# EAGLE design main_board-v2.2 (EAGLE 6.4)
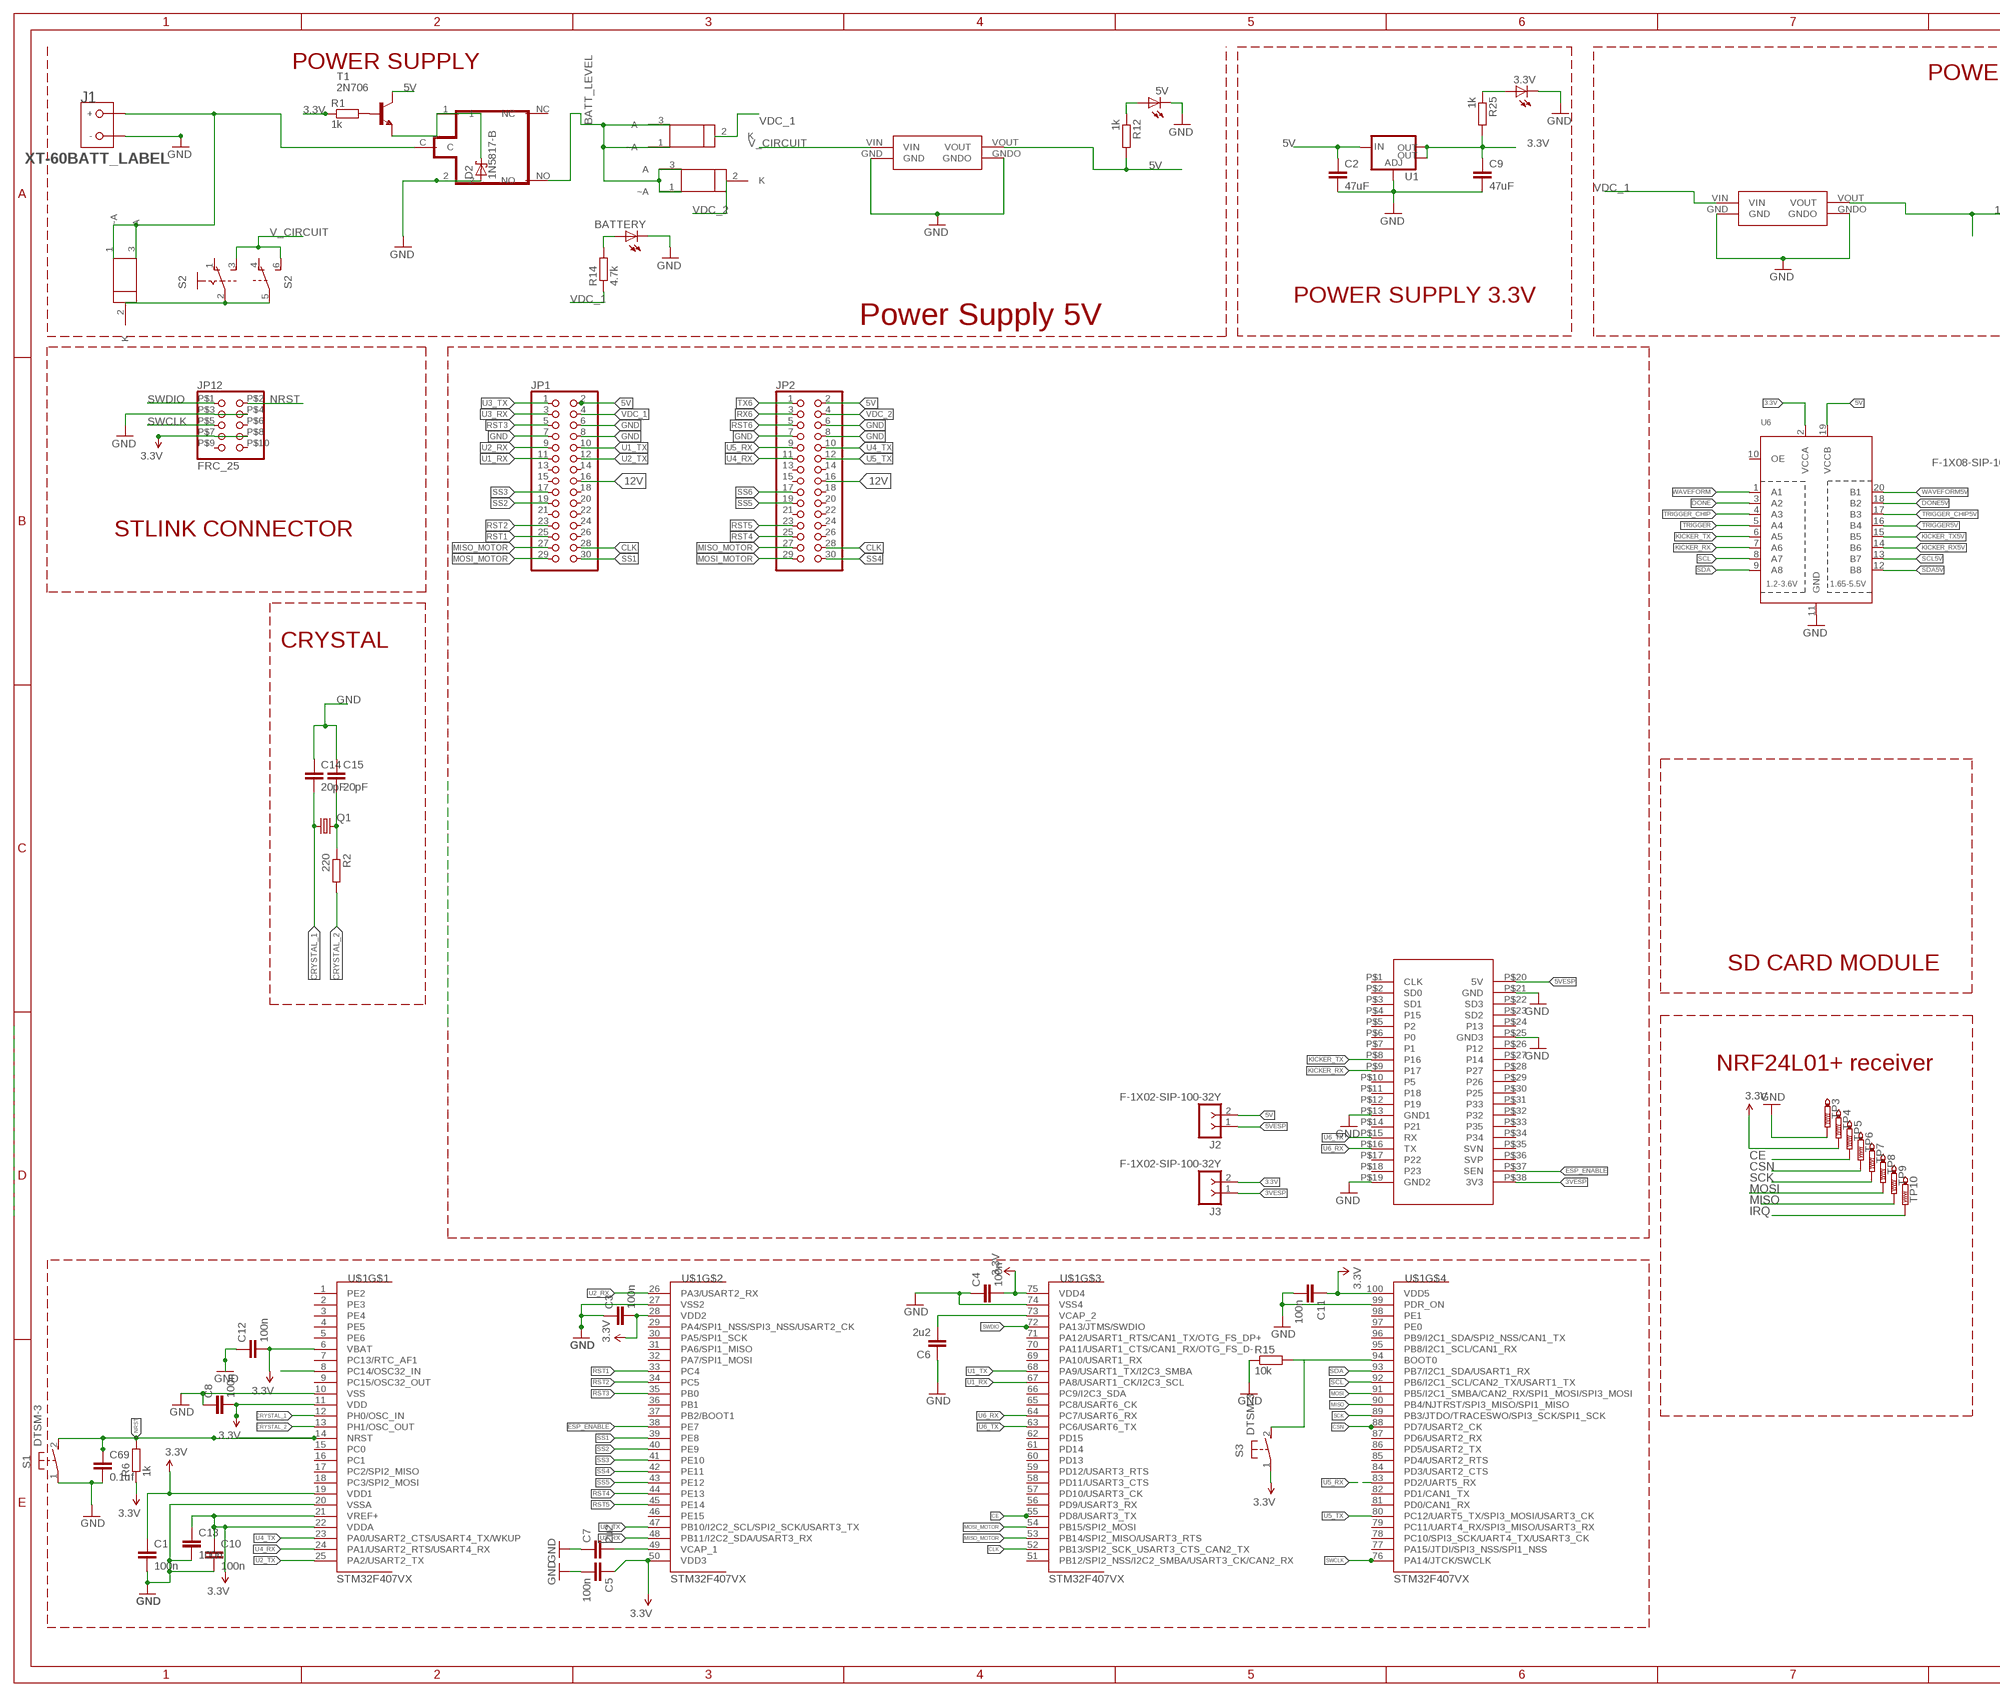
[diagram p0: schematic, sheet 1, part 1 of 2]
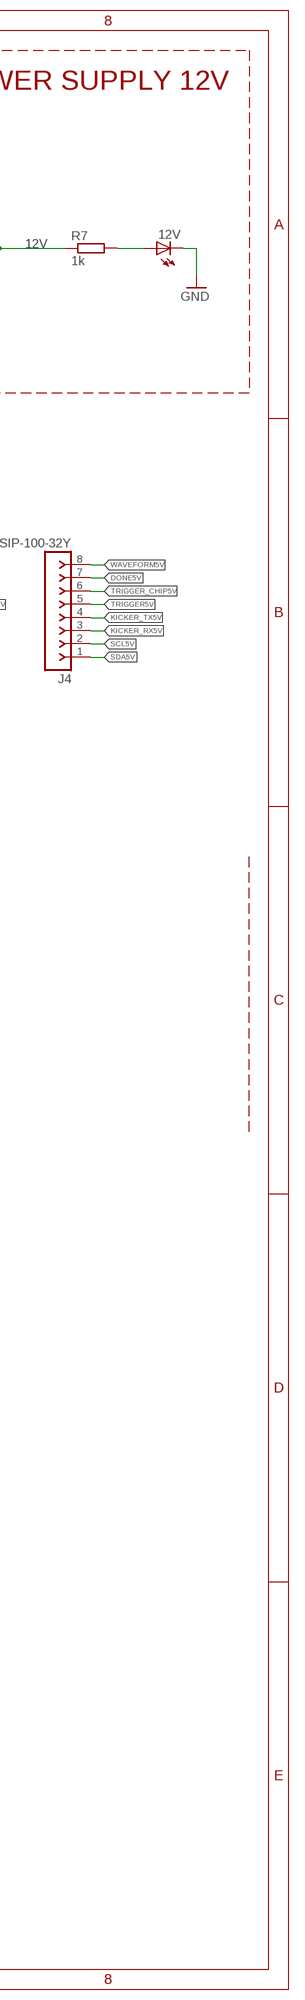
[diagram p1: schematic, sheet 1, part 2 of 2]

## Parts
3.3V  LEDCHIPLED_0805  [CHIPLED_0805]
5V  LEDCHIPLED_0805  [CHIPLED_0805]
12V  LEDCHIPLED_0805  [CHIPLED_0805]
BATTERY  LEDCHIPLED_0805  [CHIPLED_0805]
C1  100n  C-EUC1206  [C1206]
C2  47uF  C-EUC1206  [C1206]
C3  100n  C-EUC1206  [C1206]
C4  100n  C-EUC1206  [C1206]
C5  100n  C-EUC1206  [C1206]
C6  2u2  C-EUC1206  [C1206]
C7  2u2  C-EUC1206  [C1206]
C8  100n  C-EUC1206  [C1206]
C9  47uF  C-EUC1206  [C1206]
C10  100n  C-EUC1206  [C1206]
C11  100n  C-EUC1206  [C1206]
C12  100n  C-EUC1206  [C1206]
C13  100n  C-EUC1206  [C1206]
C14  20pF  C-EUC1206  [C1206]
C15  20pF  C-EUC1206  [C1206]
C69  0.1uf  C-EUC1206  [C1206]
D2  1N5817-B  [DO41-7.6]
J1  XT-60BATT_LABEL  [XT-60]
J2  F-1X02-SIP-100-32Y  [SIP-100-02-32Y]
J3  F-1X02-SIP-100-32Y  [SIP-100-02-32Y]
J4  F-1X08-SIP-100-32Y  [SIP-100-08-32Y]
JP1  PINHD-2X15_2.54  [2X15]
JP2  PINHD-2X15_2.54  [2X15]
JP12  FRC_25  [FRC2*5]
Q1  CRYSTALHC49U-V  [HC49U-V]
R1  1k  R-EU_R1206  [R1206]
R2  220  R-EU_R1206  [R1206]
R6  1k  R-EU_R1206  [R1206]
R7  1k  R-EU_R1206  [R1206]
R12  1k  R-EU_R1206  [R1206]
R14  4.7k  R-EU_R1206  [R1206]
R15  10k  R-EU_R1206  [R1206]
R25  1k  R-EU_R1206  [R1206]
S1  DTSM-3  [DTSM-3]
S2  A68-A31  [A68-A31]
S3  DTSM-3  [DTSM-3]
T1  2N706  [TO18]
TP3  PTR1PAD1-13  [P1-13]
TP4  PTR1PAD1-13  [P1-13]
TP5  PTR1PAD1-13  [P1-13]
TP6  PTR1PAD1-13  [P1-13]
TP7  PTR1PAD1-13  [P1-13]
TP8  PTR1PAD1-13  [P1-13]
TP9  PTR1PAD1-13  [P1-13]
TP10  PTR1PAD1-13  [P1-13]
U1  V_REG_LM1117SOT223  [SOT223]
U2  LP38690DT-3.3  [TO228P1042X238-3N]
U3  LP38690DT-3.3  [TO228P1042X238-3N]
U4  LP38690DT-3.3  [TO228P1042X238-3N]
U6  TXB0108PWR  [TSSOP20]
U$1  STM32F407VX  [LQFP100]
U$2  REL  [REL]
U$3  BUCK  [BUCK]
U$4  BUCK  [BUCK]
U$6  NODEMCU32S  [NODEMCU32]

## Nets
3.3V: C1.1 C3.2 C4.2 C5.1 C8.2 C9.1 C10.1 C11.1 C12.2 C13.1 J3.2 JP12.P$7 JP12.P$8 R1.1 R6.1 R25.2 S3.1 TP4.TP U1.2(OUT) U1.4(OUT) U6.2(VCCA) U$1.6(VBAT) U$1.11(VDD) U$1.19(VDD1) U$1.21(VREF+) U$1.22(VDDA) U$1.28(VDD2) U$1.50(VDD3) U$1.75(VDD4) U$1.100(VDD5)
3VESP: J3.1 U$6.P$38(3V3)
5V: C2.1 J2.2 JP1.2 JP2.2 R12.2 T1.3(C) U1.3(IN) U6.19(VCCB) U$3.VOUT
5VESP: J2.1 U$6.P$20(5V)
12V: JP1.16 JP2.16 R7.1 U$4.VOUT
BATT_LEVEL: U2.1(~A) U2.3(A) U4.1(~A) U4.3(A) U$2.NO
CE: TP5.TP U$1.55(PD8/USART3_TX)
CLK: JP1.28 JP2.28 U$1.52(PB13/SPI2_SCK_USART3_CTS_CAN2_TX)
CRYSTAL_1: C14.2 Q1.1 U$1.12(PH0/OSC_IN)
CRYSTAL_2: R2.2 U$1.13(PH1/OSC_OUT)
CSN: TP6.TP U$1.88(PD7/USART2_CK)
DONE: U6.3(A2)
DONE5V: J4.7 U6.18(B2)
ESP_ENABLE: U$1.38(PE7) U$6.P$37(SEN)
GND: 3.3V.C 5V.C 12V.C BATTERY.C C1.2 C2.2 C3.1 C4.1 C5.2 C6.1 C7.1 C8.1 C9.2 C10.2 C11.2 C12.1 C13.2 C14.1 C15.1 C69.2 D2.A J1.GND(-) JP1.6 JP1.7 JP1.8 JP2.6 JP2.7 JP2.8 JP12.P$3 JP12.P$4 R15.1 S1.1 TP3.TP U1.1(ADJ) U6.11(GND) U$1.10(VSS) U$1.20(VSSA) U$1.27(VSS2) U$1.74(VSS4) U$1.99(PDR_ON) U$2.2 U$3.GND U$3.GNDO U$4.GND U$4.GNDO U$6.P$13(GND1) U$6.P$19(GND2) U$6.P$21(GND) U$6.P$25(GND3)
INPUT: J1.BATT(+) U3.1(~A) U3.3(A) U$2.C
IRQ: TP10.TP
IRQ_SPI2: U$1.8(PC14/OSC32_IN)
KICKER_RX: U6.7(A6) U$6.P$9(P17)
KICKER_RX5V: J4.3 U6.14(B6)
KICKER_TX: U6.6(A5) U$6.P$8(P16)
KICKER_TX5V: J4.4 U6.15(B5)
MISO: TP9.TP U$1.90(PB4/NJTRST/SPI3_MISO/SPI1_MISO)
MISO_MOTOR: JP1.27 JP2.27 U$1.53(PB14/SPI2_MISO/USART3_RTS)
MOSI: TP8.TP U$1.91(PB5/I2C1_SMBA/CAN2_RX/SPI1_MOSI/SPI3_MOSI)
MOSI_MOTOR: JP1.29 JP2.29 U$1.54(PB15/SPI2_MOSI)
N$3: C7.2 U$1.49(VCAP_1)
N$4: C6.2 U$1.73(VCAP_2)
N$6: R15.2 S3.2 U$1.94(BOOT0)
N$10: C15.2 Q1.2 R2.1
N$12: 5V.A R12.1
N$14: 12V.A R7.2
N$18: BATTERY.A R14.2
N$19: 3.3V.A R25.1
N$21: R1.2 T1.2(B)
N$22: D2.C T1.1(E) U$2.1
N$25: S2.2(A:P) S2.5(B:P) U3.2(K)
NRST: C69.1 JP12.P$2 R6.2 S1.2 U$1.14(NRST)
RST1: JP1.25 U$1.33(PC4)
RST2: JP1.23 U$1.34(PC5)
RST3: JP1.5 U$1.35(PB0)
RST4: JP2.25 U$1.44(PE13)
RST5: JP2.23 U$1.45(PE14)
RST6: JP2.5
RX6: JP2.3
SCK: TP7.TP U$1.89(PB3/JTDO/TRACESWO/SPI3_SCK/SPI1_SCK)
SCL: U6.8(A7) U$1.92(PB6/I2C1_SCL/CAN2_TX/USART1_TX)
SCL5V: J4.2 U6.13(B7)
SDA: U6.9(A8) U$1.93(PB7/I2C1_SDA/USART1_RX)
SDA5V: J4.1 U6.12(B8)
SS1: JP1.30 U$1.39(PE8)
SS2: JP1.19 U$1.40(PE9)
SS3: JP1.17 U$1.41(PE10)
SS4: JP2.30 U$1.42(PE11)
SS5: JP2.19 U$1.43(PE12)
SS6: JP2.17
SWCLK: JP12.P$5 U$1.76(PA14/JTCK/SWCLK)
SWDIO: JP12.P$1 U$1.72(PA13/JTMS/SWDIO)
TRIGGER: U6.5(A4)
TRIGGER5V: J4.5 U6.16(B4)
TRIGGER_CHIP: U6.4(A3)
TRIGGER_CHIP5V: J4.6 U6.17(B3)
TX6: JP2.1
U1_RX: JP1.11 U$1.67(PA8/USART1_CK/I2C3_SCL)
U1_TX: JP1.10 U$1.68(PA9/USART1_TX/I2C3_SMBA)
U2_RX: JP1.9 U$1.26(PA3/USART2_RX)
U2_TX: JP1.12 U$1.25(PA2/USART2_TX)
U3_RX: JP1.3 U$1.48(PB11/I2C2_SDA/USART3_RX)
U3_TX: JP1.1 U$1.47(PB10/I2C2_SCL/SPI2_SCK/USART3_TX)
U4_RX: JP2.11 U$1.24(PA1/USART2_RTS/USART4_RX)
U4_TX: JP2.10 U$1.23(PA0/USART2_CTS/USART4_TX/WKUP)
U5_RX: JP2.9 U$1.83(PD2/UART5_RX)
U5_TX: JP2.12 U$1.80(PC12/UART5_TX/SPI3_MOSI/USART3_CK)
U6_RX: U$1.64(PC7/USART6_RX) U$6.P$16(TX)
U6_TX: U$1.63(PC6/USART6_TX) U$6.P$15(RX)
V_CIRCUIT: S2.3(A:S) S2.6(B:S) U$3.VIN
VDC_1: JP1.4 R14.1 U4.2(K) U$4.VIN
VDC_2: JP2.4 U2.2(K)
WAVEFORM: U6.1(A1)
WAVEFORM5V: J4.8 U6.20(B1)
Unconnected: JP1.13 JP1.14 JP1.15 JP1.18 JP1.20 JP1.21 JP1.22 JP1.24 JP1.26 JP2.13 JP2.14 JP2.15 JP2.18 JP2.20 JP2.21 JP2.22 JP2.24 JP2.26 JP12.P$6 JP12.P$9 JP12.P$10 S2.1(A:O) S2.4(B:O) U6.10(OE) U$1.1(PE2) U$1.2(PE3) U$1.3(PE4) U$1.4(PE5) U$1.5(PE6) U$1.7(PC13/RTC_AF1) U$1.9(PC15/OSC32_OUT) U$1.15(PC0) U$1.16(PC1) U$1.17(PC2/SPI2_MISO) U$1.18(PC3/SPI2_MOSI) U$1.29(PA4/SPI1_NSS/SPI3_NSS/USART2_CK) U$1.30(PA5/SPI1_SCK) U$1.31(PA6/SPI1_MISO) U$1.32(PA7/SPI1_MOSI) U$1.36(PB1) U$1.37(PB2/BOOT1) U$1.46(PE15) U$1.51(PB12/SPI2_NSS/I2C2_SMBA/USART3_CK/CAN2_RX) U$1.56(PD9/USART3_RX) U$1.57(PD10/USART3_CK) U$1.58(PD11/USART3_CTS) U$1.59(PD12/USART3_RTS) U$1.60(PD13) U$1.61(PD14) U$1.62(PD15) U$1.65(PC8/USART6_CK) U$1.66(PC9/I2C3_SDA) U$1.69(PA10/USART1_RX) U$1.70(PA11/USART1_CTS/CAN1_RX/OTG_FS_D-) U$1.71(PA12/USART1_RTS/CAN1_TX/OTG_FS_DP+) U$1.77(PA15/JTDI/SPI3_NSS/SPI1_NSS) U$1.78(PC10/SPI3_SCK/UART4_TX/USART3_CK) U$1.79(PC11/UART4_RX/SPI3_MISO/USART3_RX) U$1.81(PD0/CAN1_RX) U$1.82(PD1/CAN1_TX) U$1.84(PD3/USART2_CTS) U$1.85(PD4/USART2_RTS) U$1.86(PD5/USART2_TX) U$1.87(PD6/USART2_RX) U$1.95(PB8/I2C1_SCL/CAN1_RX) U$1.96(PB9/I2C1_SDA/SPI2_NSS/CAN1_TX) U$1.97(PE0) U$1.98(PE1) U$2.NC U$6.P$1(CLK) U$6.P$2(SD0) U$6.P$3(SD1) U$6.P$4(P15) U$6.P$5(P2) U$6.P$6(P0) U$6.P$7(P1) U$6.P$10(P5) U$6.P$11(P18) U$6.P$12(P19) U$6.P$14(P21) U$6.P$17(P22) U$6.P$18(P23) U$6.P$22(SD3) U$6.P$23(SD2) U$6.P$24(P13) U$6.P$26(P12) U$6.P$27(P14) U$6.P$28(P27) U$6.P$29(P26) U$6.P$30(P25) U$6.P$31(P33) U$6.P$32(P32) U$6.P$33(P35) U$6.P$34(P34) U$6.P$35(SVN) U$6.P$36(SVP)

## Notes on the sheet
- POWER SUPPLY
- POWER SUPPLY 12V
- POWER SUPPLY 3.3V
- Power Supply 5V
- STLINK CONNECTOR
- CRYSTAL
- SD CARD MODULE
- NRF24L01+ receiver

## Library data of the parts
3.3V 5V 12V BATTERY = led:LED: LED OSRAM: - CHIPLED LG R971, LG N971, LY N971, LG Q971, LY Q971, LO R971, LY R971 LH N974, LH R974 LS Q976, LO Q976, LY Q976 LO Q996 - Hyper CHIPLED LW Q18S LB Q993, LB Q99A, LB R99A - SideLED LS A670, LO A670, LY A670, LG A670, LP A670 LB A673, LV A673, LT A673, LW A673 LH A674 LY A675 LS A676, LA A676, LO A676, LY A676, LW A676 LS A679, LY A679, LG A679 - Hyper Micro SIDELED® LS Y876, LA Y876, LO Y876, LY Y876 LT Y87S - SmartLED LW L88C, LW L88S LB L89C, LB L89S, LG L890 LS L89K, LO L89K, LY L89K LS L896, LA L896, LO L896, LY L896 - TOPLED LS T670, LO T670, LY T670, LG T670, LP T670 LSG T670, LSP T670, LSY T670, LOP T670, LYG T670 LG T671, LOG T671, LSG T671 LB T673, LV T673, LT T673, LW T673 LH T674 LS T676, LA T676, LO T676, LY T676, LB T676, LH T676, LSB T676, LW T676 LB T67C, LV T67C, LT T67C, LS T67K, LO T67K, LY T67K, LW E67C LS E67B, LA E67B, LO E67B, LY E67B, LB E67C, LV E67C, LT E67C LW T67C LS T679, LY T679, LG T679 LS T770, LO T770, LY T770, LG T770, LP T770 LB T773, LV T773, LT T773, LW T773 LH T774 LS E675, LA E675, LY E675, LS T675 LS T776, LA T776, LO T776, LY T776, LB T776 LHGB T686 LT T68C, LB T68C - Hyper Mini TOPLED® LB M676 - Mini TOPLED Santana® LG M470 LS M47K, LO M47K, LY M47K Source: http://www.osram.convergy.de LUXEON: - LUMILED® LXK2-PW12-R00, LXK2-PW12-S00, LXK2-PW14-U00, LXK2-PW14-V00 LXK2-PM12-R00, LXK2-PM12-S00, LXK2-PM14-U00 LXK2-PE12-Q00, LXK2-PE12-R00, LXK2-PE12-S00, LXK2-PE14-T00, LXK2-PE14-U00 LXK2-PB12-K00, LXK2-PB12-L00, LXK2-PB12-M00, LXK2-PB14-N00, LXK2-PB14-P00, LXK2-PB14-Q00 LXK2-PR12-L00, LXK2-PR12-M00, LXK2-PR14-Q00, LXK2-PR14-R00 LXK2-PD12-Q00, LXK2-PD12-R00, LXK2-PD12-S00 LXK2-PH12-R00, LXK2-PH12-S00 LXK2-PL12-P00, LXK2-PL12-Q00, LXK2-PL12-R00 Source: www.luxeon.com KINGBRIGHT: KA-3528ASYC Source: www.kingbright.com
C1-C15 C69 = rcl:C-EU: CAPACITOR, European symbol
D2 = diode:1N581*: 1.0A SCHOTTKY BARRIER RECTIFIER Source: http://www.diodes.com/datasheets/ds23001.pdf
J1 = RoboJackets-Connectors:XT-60: XT-60 Power Connector Distributor: HobbyKing <http://www.hobbyking.com/hobbyking/store/RC_PRODUCT_SEARCH.asp?strSearch=xt-60>
J2 J3 = con-headers-jp:F-1X02-: FEMALE HEADER
J4 = con-headers-jp:F-1X08-: FEMALE HEADER
JP1 JP2 = pinhead-1:PINHD-2X15: PIN HEADER
JP12 = mohit:FRC_2*5
Q1 = crystal:CRYSTAL: CRYSTAL; OC_FARNELL: 1666969; OC_NEWARK: unknown
R1 R2 R6 R7 R12 R14 R15 R25 = resistor:R-EU_: RESISTOR, European symbol
S1 S3 = switch-tact:DTSM-3
S2 = switch:A68-A31: SLIDING SWITCH Siemens, distributor Buerklin, 11G766
T1 = transistor:2N706: NPN TRANSISTOR
TP3-TP10 = testpad:PTR1: TEST PIN
U1 = SparkFun-PowerIC:V_REG_LM1117: Voltage Regulator LM1117 Standard adjustable voltage regulator but in SMD form. Spark Fun Electronics SKU : COM-00595; PROD_ID: VREG-08170
U2-U4 = LP38690DT-3.3:LP38690DT-3.3; MPN: LP38690DT-3.3; OC_FARNELL: 1008048; OC_NEWARK: 41K7439; PACKAGE: TO-252; SUPPLIER: National Semiconductor
U6 = adafruit:TXB0108PWR: 8-Bit Bi-Directional Level Shifter 1.2V-3.6V (VCCA) to 1.65V-5.5V (VCCB) bi-directional level shifter with auto direction sensing. Max data rate - VCCA 1.8V: 20Mbps (50ns), VCCA 3.3V: 100Mbps (10ns) Digikey: 296-21527-1-ND
U$1 = STM32F407Vx_LQFP100:STM32F407VX: STmicroelectronics Cortex M4 Series Typ: STM32F407Vx LQFP100 Copyright 2012 by Ersan Günes, Quantitec, info@quantitec.de
U$2 = rel:REL
U$3 U$4 = BUCK:BUCK
U$6 = nodeMCU:NODEMCU32S

## Board
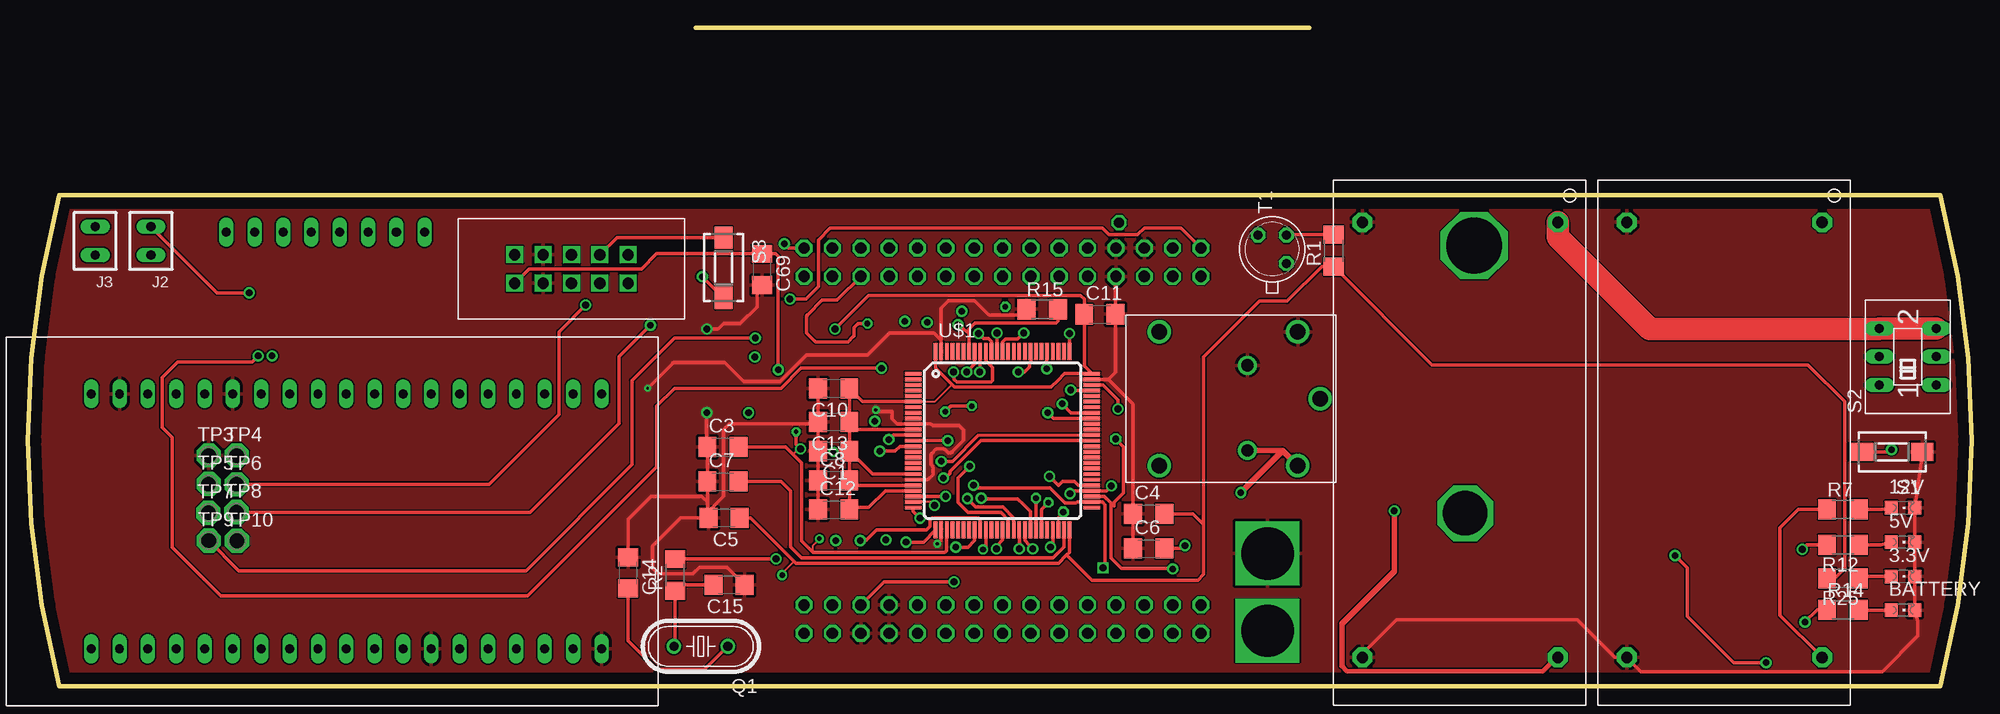
[diagram p2: board, top side]
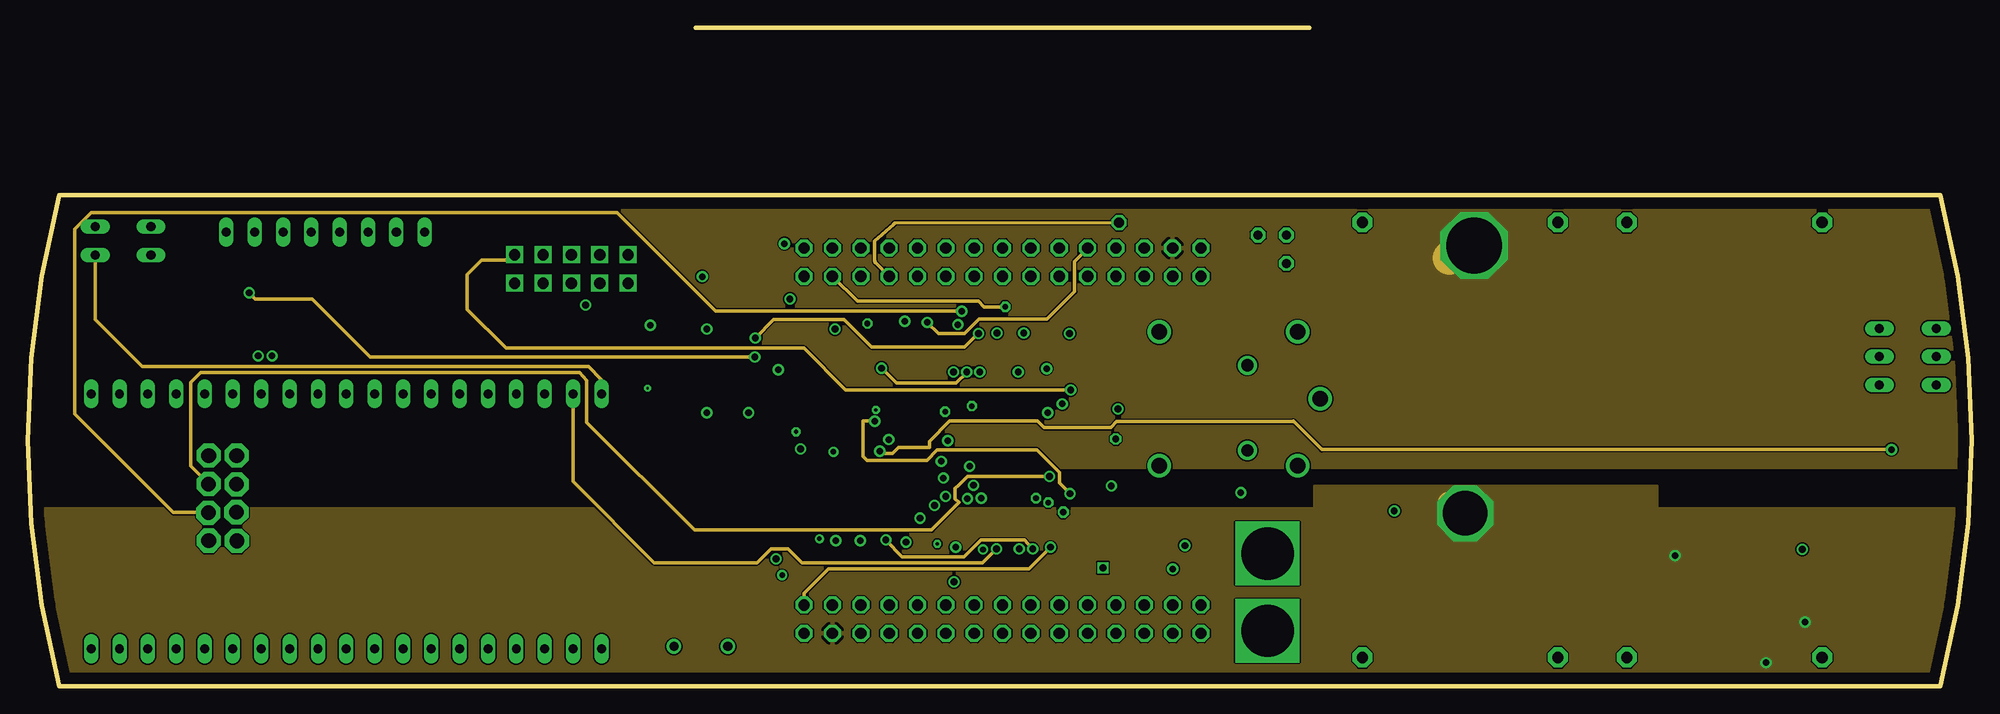
[diagram p3: board, inner layer Route2]
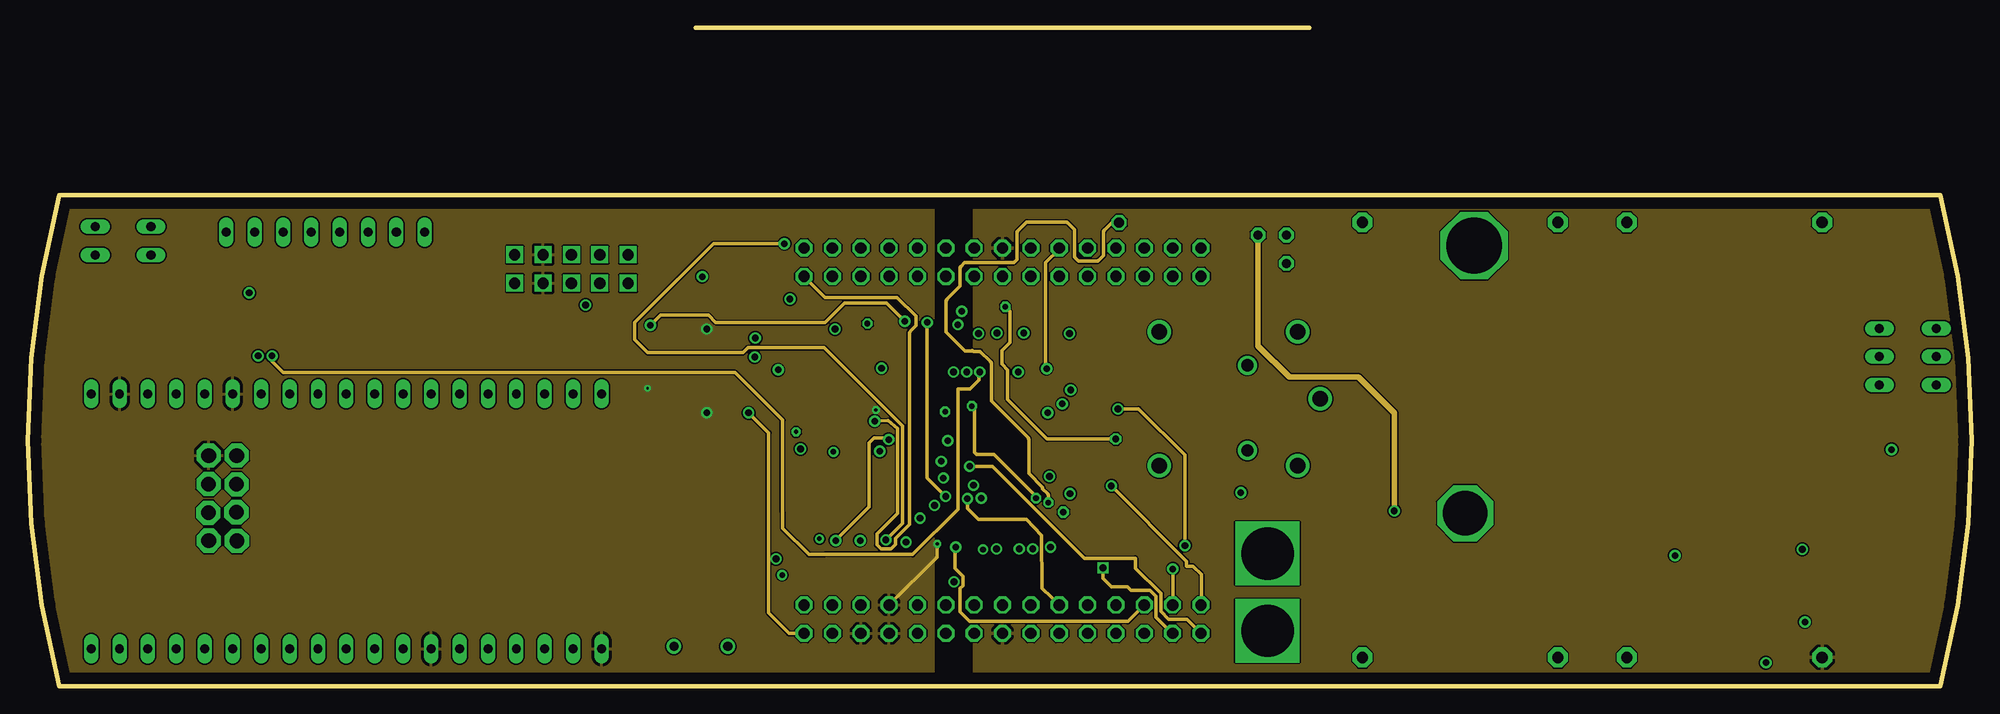
[diagram p4: board, inner layer Route15]
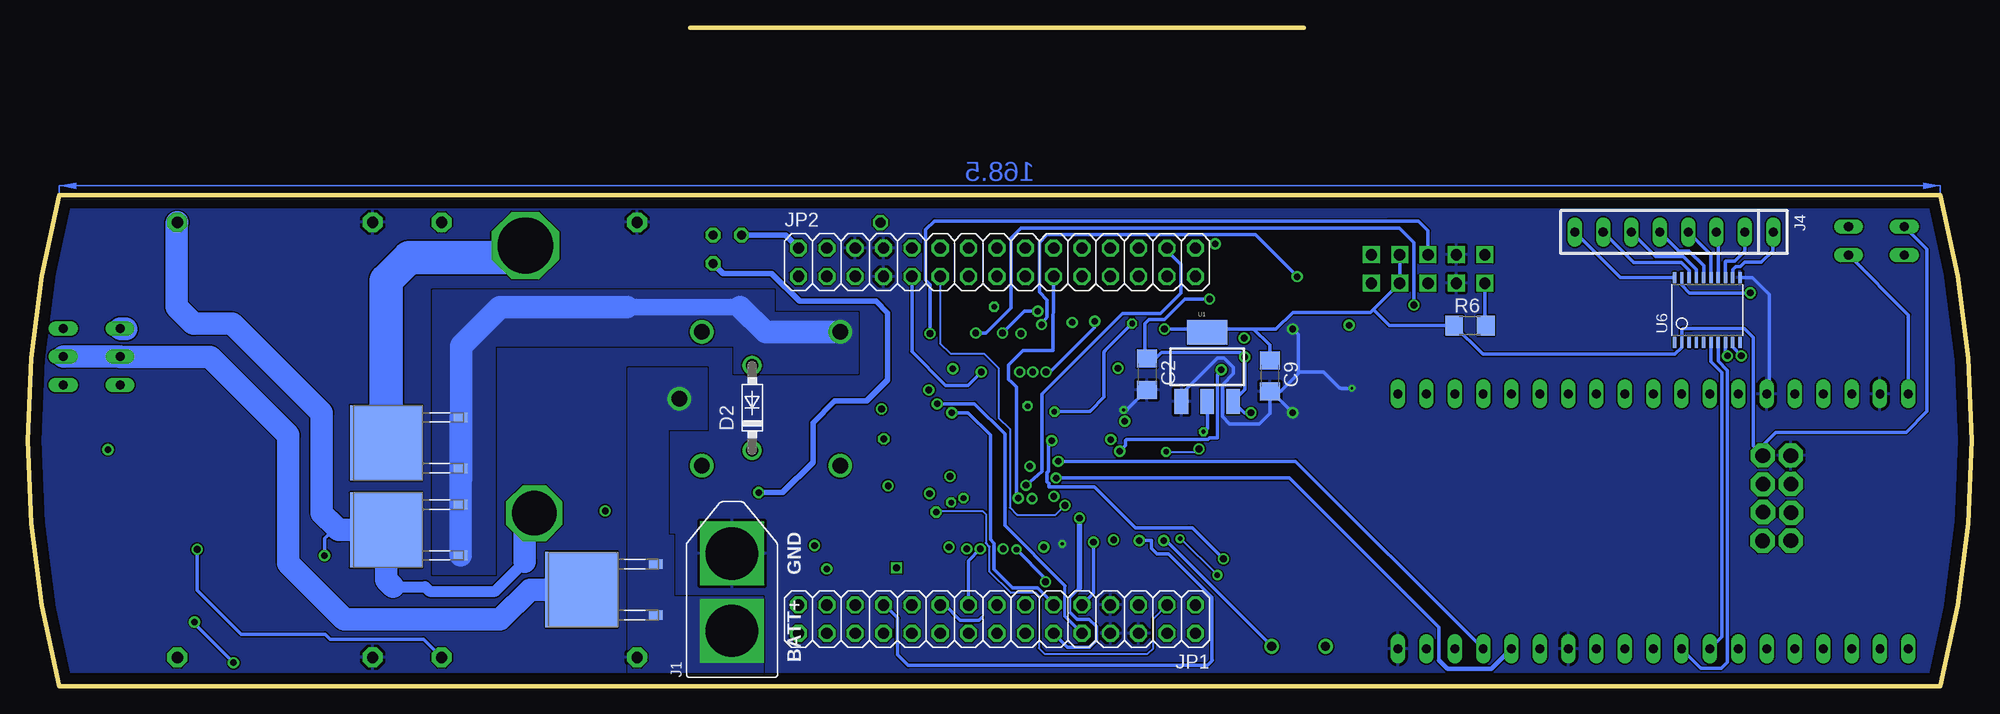
[diagram p5: board, bottom side, seen from below]

Size 174.15 x 59 mm. Coordinates in mm from the lower left corner, seen from the top.
Outline: 114.83,59 59.83,59
Outline: 2.83,44 171.33,44 arc-29 171.33,0 2.83,0 arc-29 2.83,44
Copper layers (1*2*15*16): Top 0.035mm / dielectric 0.8mm / Route2 0.05mm / dielectric 0.63mm / Route15 0.05mm / dielectric 0.8mm / Bottom 0.035mm
Design rules "default *": minimum track width 10mil, minimum drill 24mil, track to track 0.125mm, track to pad 0.125mm, pad to pad 0.125mm, via to via 0.125mm, smd to smd 0.125mm, copper to edge 40mil, drill to drill 8mil, minimum pad ring 10mil, minimum via ring 8mil, stop-mask expansion 4mil, vias tented up to drill 0mil, thermal gap 10mil

### Footprints (pad centres in the part's own frame; a part is rotated, then mirrored left to right if it is on the bottom)
CHIPLED_0805 = smd 1.2 x 1.2: A 0,-1.05; C 0,1.05
C1206 = smd 1.6 x 1.8: 1 -1.4,0; 2 1.4,0
DO41-7.6 = drill 1.1 pad 1.7: A 3.81,0; C -3.81,0
XT-60 = drill 4.7 square: BATT 0,4.154; GND 0,11.092
SIP-100-02-32Y = drill 0.813 long: 1 -1.27,0; 2 1.27,0
SIP-100-08-32Y = drill 0.813 long: 1 -8.89,0; 2 -6.35,0; 3 -3.81,0; 4 -1.27,0; 5 1.27,0; 6 3.81,0; 7 6.35,0; 8 8.89,0
2X15 = drill 1.016 octagon: 1 -17.78,-1.27; 2 -17.78,1.27; 3 -15.24,-1.27; 4 -15.24,1.27; 5 -12.7,-1.27; 6 -12.7,1.27; 7 -10.16,-1.27; 8 -10.16,1.27; 9 -7.62,-1.27; 10 -7.62,1.27; 11 -5.08,-1.27; 12 -5.08,1.27; 13 -2.54,-1.27; 14 -2.54,1.27; 15 0,-1.27; 16 0,1.27; 17 2.54,-1.27; 18 2.54,1.27; 19 5.08,-1.27; 20 5.08,1.27; 21 7.62,-1.27; 22 7.62,1.27; 23 10.16,-1.27; 24 10.16,1.27; 25 12.7,-1.27; 26 12.7,1.27; 27 15.24,-1.27; 28 15.24,1.27; 29 17.78,-1.27; 30 17.78,1.27
FRC2*5 = drill 1.016 square: P$1 -5.08,1.27; P$2 -5.08,-1.27; P$3 -2.54,1.27; P$4 -2.54,-1.27; P$5 0,1.27; P$6 0,-1.27; P$7 2.54,1.27; P$8 2.54,-1.27; P$9 5.08,1.27; P$10 5.08,-1.27
HC49U-V = drill 0.813: 1 -2.413,0; 2 2.413,0
R1206 = smd 1.6 x 1.803: 1 -1.422,0; 2 1.422,0
DTSM-3 = smd 2 x 1.6: 1 -2.7,0; 2 2.7,0
A68-A31 = drill 0.813 long: 1 -2.54,-2.54; 2 0,-2.54; 3 2.54,-2.54; 4 -2.54,2.54; 5 0,2.54; 6 2.54,2.54
TO18 = drill 0.813 octagon: 1 -1.27,-1.27; 2 1.27,-1.27; 3 1.27,1.27
P1-13 = drill 1.321 pad 2.159 octagon: TP 0,0
SOT223 = smd 1.219 x 2.235: 1 -2.311,-3.099; 2 0,-3.099; 3 2.311,-3.099 | smd 3.6 x 2.2: 4 0,3.099
TO228P1042X238-3N = smd 0.889 x 1.219: 1 -2.286,-6.502; 3 2.286,-6.502 | smd 6.731 x 6.502: 2 0,0.152
TSSOP20 = smd 0.305 x 0.991: 1 -2.925,-2.918; 2 -2.275,-2.918; 3 -1.625,-2.918; 4 -0.975,-2.918; 5 -0.325,-2.918; 6 0.325,-2.918; 7 0.975,-2.918; 8 1.625,-2.918; 9 2.275,-2.918; 10 2.925,-2.918; 11 2.925,2.918; 12 2.275,2.918; 13 1.625,2.918; 14 0.975,2.918; 15 0.325,2.918; 16 -0.325,2.918; 17 -0.975,2.918; 18 -1.625,2.918; 19 -2.275,2.918; 20 -2.925,2.918
LQFP100 = smd 1.5 x 0.35: 1 -8,6; 2 -8,5.5; 3 -8,5; 4 -8,4.5; 5 -8,4; 6 -8,3.5; 7 -8,3; 8 -8,2.5; 9 -8,2; 10 -8,1.5; 11 -8,1; 12 -8,0.5; 13 -8,0; 14 -8,-0.5; 15 -8,-1; 16 -8,-1.5; 17 -8,-2; 18 -8,-2.5; 19 -8,-3; 20 -8,-3.5; 21 -8,-4; 22 -8,-4.5; 23 -8,-5; 24 -8,-5.5; 25 -8,-6; 51 8,-6; 52 8,-5.5; 53 8,-5; 54 8,-4.5; 55 8,-4; 56 8,-3.5; 57 8,-3; 58 8,-2.5; 59 8,-2; 60 8,-1.5; 61 8,-1; 62 8,-0.5; 63 8,0; 64 8,0.5; 65 8,1; 66 8,1.5; 67 8,2; 68 8,2.5; 69 8,3; 70 8,3.5; 71 8,4; 72 8,4.5; 73 8,5; 74 8,5.5; 75 8,6 | smd 0.35 x 1.5: 26 -6,-8; 27 -5.5,-8; 28 -5,-8; 29 -4.5,-8; 30 -4,-8; 31 -3.5,-8; 32 -3,-8; 33 -2.5,-8; 34 -2,-8; 35 -1.5,-8; 36 -1,-8; 37 -0.5,-8; 38 0,-8; 39 0.5,-8; 40 1,-8; 41 1.5,-8; 42 2,-8; 43 2.5,-8; 44 3,-8; 45 3.5,-8; 46 4,-8; 47 4.5,-8; 48 5,-8; 49 5.5,-8; 50 6,-8; 76 6,8; 77 5.5,8; 78 5,8; 79 4.5,8; 80 4,8; 81 3.5,8; 82 3,8; 83 2.5,8; 84 2,8; 85 1.5,8; 86 1,8; 87 0.5,8; 88 0,8; 89 -0.5,8; 90 -1,8; 91 -1.5,8; 92 -2,8; 93 -2.5,8; 94 -3,8; 95 -3.5,8; 96 -4,8; 97 -4.5,8; 98 -5,8; 99 -5.5,8; 100 -6,8
REL = drill 1.4: 1 6.2,-6.4; 2 6.2,5.6; C 8.2,-0.4; NC -6.2,-6.4; NO -6.2,5.6
BUCK = drill 1.016 pad 1.778 octagon: GND 0,0; GNDO 39,0; VIN 0,17.5; VOUT 39,17.5
NODEMCU32 = drill 0.8 long: P$1 0,0; P$2 0,-2.54; P$3 0,-5.08; P$4 0,-7.62; P$5 0,-10.16; P$6 0,-12.7; P$7 0,-15.24; P$8 0,-17.78; P$9 0,-20.32; P$10 0,-22.86; P$11 0,-25.4; P$12 0,-27.94; P$13 0,-30.48; P$14 0,-33.02; P$15 0,-35.56; P$16 0,-38.1; P$17 0,-40.64; P$18 0,-43.18; P$19 0,-45.72; P$20 22.86,0; P$21 22.86,-2.54; P$22 22.86,-5.08; P$23 22.86,-7.62; P$24 22.86,-10.16; P$25 22.86,-12.7; P$26 22.86,-15.24; P$27 22.86,-17.78; P$28 22.86,-20.32; P$29 22.86,-22.86; P$30 22.86,-25.4; P$31 22.86,-27.94; P$32 22.86,-30.48; P$33 22.86,-33.02; P$34 22.86,-35.56; P$35 22.86,-38.1; P$36 22.86,-40.64; P$37 22.86,-43.18; P$38 22.86,-45.72

### Placement (x,y rotation side)
3.3V  168.01,9.83 270 top
5V  168.01,12.9 270 top
12V  168.01,15.98 270 top
BATTERY  168.01,6.81 270 top
C1  72.2,21.06 180 top
C2  73.89,27.95 270 bottom
C3  62.28,21.44 0 top
C4  100.43,15.44 0 top
C5  62.38,15.06 180 top
C6  100.43,12.33 0 top
C7  62.28,18.33 0 top
C8  72.2,18.44 0 top
C9  62.89,27.8 270 bottom
C10  72.2,26.67 180 top
C11  96.05,33.33 0 top
C12  72.2,15.83 0 top
C13  72.2,23.67 180 top
C14  53.77,10.15 270 top
C15  62.83,9.06 180 top
C69  65.77,37.35 270 top
D2  109.27,24.94 90 bottom
J1  111.07,0.8 0 bottom
J2  11.03,39.9 90 top
J3  6.03,39.9 90 top
J4  26.67,40.7 180 bottom
JP1  87.33,6 180 bottom
JP2  87.33,38 0 bottom
JP12  48.7,37.39 0 top
Q1  60.3,3.56 180 top
R1  117,39.04 90 top
R2  58,9.96 90 top
R6  44.95,32.33 0 bottom
R7  162.63,15.83 0 top
R12  162.63,12.67 180 top
R14  162.63,6.83 0 top
R15  90.89,33.78 0 top
R25  162.63,9.67 180 top
S1  167.03,21 180 top
S2  168.44,29.53 90 top
S3  62.33,37.5 270 top
T1  111.5,39.16 90 top
TP3  16.2,20.66 0 top
TP4  18.72,20.66 0 top
TP5  16.19,18.11 0 top
TP6  18.7,18.09 0 top
TP7  16.17,15.54 0 top
TP8  18.69,15.59 0 top
TP9  16.21,13.04 0 top
TP10  18.73,13.01 0 top
U1  68.49,28.62 0 bottom
U2  141.89,21.81 90 bottom
U3  124.39,8.65 90 bottom
U4  141.89,13.99 90 bottom
U6  23.69,33.71 0 bottom
U$1  87.33,22 0 top
U$2  107.58,26.15 0 top
U$3  119.58,41.57 270 top
U$4  143.27,41.57 270 top
U$6  5.67,3.34 90 top

### Tracks (layer width: path | path; a pad name or v marks a point on that pad's centre or on a via)
3.3V  (via drill 0.4, 0.5, 0.6)
  Top 0.2: C1.1 72.34,21.06 v72.18,21 | v69.23,21.25 69.03,21.25 68.55,20.77 | 70.33,12 70.33,12.6 v70.93,13.2 | v67.58,9.95 67.58,10.1 68.65,11.18 | U$1.6 81.28,25.5 82.8,27.02
  Top 0.3: C13.1 C10.1 74.77,25.5 U$1.6 | C13.1 C1.1 | C8.2 C1.1 | C8.2 C12.2 73.77,16 75.33,16 76.83,17.5 U$1.22 | U$1.21 74.04,18 C8.2 | U$1.19 75.66,19 C1.1 | U$1.11 74.27,23 C13.1 | C3.2 67.89,21.44 68.55,20.77 69.33,20 69.33,13 70.33,12 82.07,12 arc90 82.33,12.25 U$1.28 | C5.1 64.77,15.06 68.65,11.18 68.83,11 92.33,11 93.08,11.75 | 93.08,11.75 93.33,12 U$1.50 | 81.33,28.5 U$1.100 | C4.2 104.39,15.44 105.33,14.5 | 105.33,14.5 105.33,10 104.83,9.5 95.33,9.5 93.08,11.75 | v72.33,32 75.33,35 94.33,35 94.65,34.68 C11.1 94.65,28.68 U$1.75 92.88,28 92.28,27.4 | 105.33,14.5 105.33,29.5 110.33,34.5 112.83,34.5 115.94,37.62 R1.1 125.81,28.8 159.48,28.8 162.78,25.5 162.78,10.55 161.9,9.67 R25.2 | S3.1 52.78,40.2 JP12.P$7 | v68.83,22.8 68.83,21.65 v69.23,21.25
  Top 0.305: 81.33,28.5 82.8,27.02 83.03,26.8 91.68,26.8 92.28,27.4
  Bottom 0.2: v72.18,21 69.48,21 v69.23,21.25 | v70.93,13.2 70.83,13.2 v67.58,9.95
  Bottom 0.3: v72.33,32 68.77,32 U1.4 68.2,32 64.33,32 | C9.1 62.89,30.56 64.33,32 | 64.33,32 62.33,32 60.83,33.5 53.86,33.5 53.59,33.77 | 53.59,33.77 JP12.P$8 JP12.P$7 | R6.1 52.16,32.33 53.59,33.77 | U1.2 68.49,23.09 v68.83,22.8 | 25.96,31.16 25.96,31.96 25.88,32.05 25.08,32.05
  Bottom 0.305: 25.08,32.05 20.38,32.05 19.58,31.25 19.58,21.52 TP4.TP 18.72,21.56 17.53,22.75 5.88,22.75 4.03,24.6 4.03,39.17 J3.2 | 25.96,31.16 U6.2 25.96,30.37 26.58,29.75 43.79,29.75 R6.1
3VESP
  Route2 0.305: J3.1 6.03,32.85 10.23,28.65 50.23,28.65 51.38,27.5 U$6.P$38
5V  (via drill 0.6)
  Top 0.3: R12.2 159.4,12.67 v158.98,12.25
  Top 0.305: v19.83,35.25 16.95,35.25 J2.2 | JP2.2 103.33,41.05 100.03,41.05 99.43,40.45 96.88,40.45 96.28,41.05 71.88,41.05 70.83,40 70.83,35.8 69.73,34.7 v68.28,34.7
  Top 0.406: 117.73,1.8 118.18,1.35 135.73,1.35 136.95,2.57 U$3.VOUT
  Top 0.5: v122.43,15.7 122.43,10.3 117.73,5.6 117.73,1.8
  Route2 0.305: v65.13,29.5 30.68,29.5 25.48,34.7 20.38,34.7 v19.83,35.25
  Route15 0.305: v64.58,24.5 66.38,22.7 66.38,6.55 68.2,4.73 JP1.2
  Route15 0.5: T1.3 110.23,30.5 113.03,27.7 119.23,27.7 122.43,24.5 v122.43,15.7
  Bottom 0.3: 73.74,29.5 C2.1 | v158.98,12.25 158.98,8.6 155.03,4.65 147.53,4.65 147.08,4.2 138.71,4.2 U$3.VOUT
  Bottom 0.305: U6.19 25.96,35.94 25.28,35.25 v19.83,35.25 | v64.58,24.5 65.15,24.5 U1.3 65.13,26.57 v65.13,29.5 65.53,29.9 72.58,29.9 73.13,29.35 C2.1 74.08,29.54 74.08,32.5 73.73,32.85 72.33,32.85 70.48,34.7 v68.28,34.7
  Bottom 0.5: T1.3 106.27,40.43 JP2.2
5VESP
  Bottom 0.305: U$6.P$20 5.67,33.27 J2.1
12V
  Top 0.3: R7.1 158.61,15.83 156.98,14.2 156.98,6.36 U$4.VOUT
  pour Route15: 86.33,5.3 86.33,0.75 161.98,0.75 161.98,5.3
  pour Route15: 86.33,34.05 86.33,43.15 161.98,43.15 161.98,33 157.83,33 157.83,4.8 153.78,4.8 153.68,34.05
  pour Route15 (rank 6): 85.33,47.1 84.73,47.1 84.73,-8.1 174.33,-8.1 174.33,51.7 85.33,51.7
BATT_LEVEL
  Bottom 1.5: 110.33,34 120.48,34
  Bottom 2: U4.1 U4.3 U2.1 | U2.1 135.38,18.5 135.33,18.56 135.33,30.5 131.83,34 120.48,34 | U2.1 U2.3 | U$2.NO 108.08,31.75 110.33,34
  pour Bottom (no thermals): 99.83,33.5 99.83,28 110.83,28 110.83,30.5 132.33,30.5 132.33,10 137.83,10 137.83,35.5 107.33,35.5 107.33,33.5
CE  (via drill 0.6)
  Top 0.3: U$1.55 94.13,18 93.78,18.35 92.68,18.35 92.33,18
  Top 0.305: 92.33,18 v91.53,18.8
  Route2 0.3: 83.43,18.05 83.08,17.7 83.08,16.8 83.43,16.45
  Route2 0.305: v91.53,18.8 84.18,18.8 83.43,18.05 | 83.43,16.45 80.98,14 59.73,14 50.08,23.65 50.08,27.4 49.43,28.1 15.48,28.1 14.58,27.2 14.58,19.72 TP5.TP
CLK  (via drill 0.6)
  Top 0.3: U$1.52 94.03,16.5 93.93,16.4 92.93,16.4 91.58,17.75 84.98,17.75 v84.73,18 | 96.53,16.25 96.53,10.8 v96.33,10.6
  Top 0.305: U$1.52 96.28,16.5 96.53,16.25
  Route15 0.3: v96.33,10.6 96.33,9.65 97.08,8.9 98.53,8.9 98.83,8.6
  Route15 0.305: JP1.28 102.5,4.73 101.08,6.15 101.08,8.05 100.53,8.6 98.83,8.6
  Bottom 0.3: JP2.28 72.09,39.06 70.83,37.8 70.83,35.25 72.68,33.4 76.08,33.4 83.28,26.2 83.28,19.25 v84.73,18
CRYSTAL_1  (via drill 0.6)
  Top 0.3: C14.2 53.77,4.06 56.33,1.5 60.65,1.5 Q1.1 | U$1.12 77.58,22.5 v77.13,22.1
  Route15 0.3: 75.83,22.25 77.03,22.25 v77.13,22.1
  Route15 0.305: 75.83,22.25 75.38,21.8 75.38,16.05 v72.38,13.05
  Bottom 0.305: v72.38,13.05 72.2,13.05 Q1.1
CRYSTAL_2  (via drill 0.6)
  Top 0.305: U$1.13 v82.43,22 | v67.03,11.4 58.01,11.4 R2.2
  Bottom 0.3: 70.13,14.2 69.83,14.2 v67.03,11.4 | 82.68,17.85 82.68,18.15 82.83,18.3 82.83,19.15 82.73,19.25
  Bottom 0.305: v82.43,22 82.73,21.7 82.73,19.25 | 82.68,17.85 78.58,17.85 74.93,14.2 70.13,14.2
CSN  (via drill 0.6)
  Top 0.305: TP6.TP 41.32,18.09 47.58,24.35 47.58,31.75 v49.98,34.15 | U$1.88 87.33,30.85 87.58,31.1 88.68,31.1 v89.23,31.65
  Bottom 0.305: v49.98,34.15 49.98,39.75 51.28,41.05 85.18,41.05 86.08,40.15 86.08,33.9 88.33,31.65 v89.23,31.65
DONE5V
  Bottom 0.3: U6.18 25.31,37.23 26.03,37.95 30.27,37.95 J4.7
ESP_ENABLE  (via drill 0.6)
  Top 0.305: U$1.38 87.33,13.1 86.83,12.55 v86.78,12.3
  Route2 0.305: v86.78,12.3 85.53,11.05 69.38,11.05 68.13,12.3 66.58,12.3 65.33,11.05 56.13,11.05 48.85,18.33 U$6.P$37
GND  (via drill 0.2, 0.3, 0.6)
  Top 0.3: C10.2 C13.2 | C13.2 C1.2 C8.1 C12.1 | 60.88,16.5 C7.1 C3.1 60.83,21.49 v60.83,24.5 | 60.88,16.5 60.88,15.16 C5.2 60.98,15.65 62.33,17 62.33,23 62.83,23.5 70.63,23.5 C13.2 | 96.83,27.5 99.03,25.3 C4.1 C6.1 | 96.83,27.5 U$1.74 | 96.83,27.5 97.45,28.12 C11.2 97.45,36.69 JP2.7 | C14.1 53.77,14.94 55.83,17 60.38,17 60.88,16.5 | v60.83,32 61.83,32 62.33,32.5 63.83,32.5 65.33,34 65.33,35.51 C69.2 | U$3.GNDO 119.41,2.4 119.08,2.4 122.63,5.95 138.83,5.95 142.21,2.57 U$4.GNDO 144.54,1.3 166.13,1.3 169.33,4.51 169.33,5.85 BATTERY.C 3.3V.C 5V.C 12V.C 169.76,20.97 S1.1 | U$1.27 81.83,13.21 arc-45 81.75,13.03 v81.48,12.75 | U$1.20 80.52,18.5 arc45 80.7,18.57 81.08,18.95 81.08,19.59 arc45 81,19.77 80.93,19.85 80.93,20.7 arc-45 81,20.87 81.38,21.25 82.02,21.25 arc-45 82.2,21.18 82.48,20.9 82.62,20.9 arc45 82.8,20.97 83.83,22 83.83,22.95 83.43,23.35 81.18,23.35 arc-45 81,23.42 80.93,23.5 U$1.10 77.88,23.5 77.43,23.95 77.43,24.6 76.23,24.6 arc-45 76.05,24.67 v75.98,24.75 | R15.1 89.01,33.32 arc-45 88.83,33.25 86.13,33.25 84.9,34.48 arc45 84.72,34.55 82.48,34.55 81.9,33.97 arc45 81.83,33.8 U$1.99 81.83,30.89 arc45 81.75,31.07 81.18,31.65 77.28,31.65 arc45 77.1,31.58 75.23,29.7 69.88,29.7 arc45 69.7,29.63 67.38,27.3 64.23,27.3 arc-45 64.05,27.37 62.43,29 57.93,29 arc45 57.75,28.93 v55.53,26.7
  Top 0.305: C15.1 62.64,10.65 60.18,10.65 59.58,10.05 56.48,10.05 55.98,10.55 55.98,12.55 58.49,15.06 C5.2
  Route15 0.3: v81.48,12.75 81.48,11.69 arc-45 81.4,11.51 JP1.7
  Bottom 0.3: C9.2 62.89,24.44 63.83,23.5 | U1.1 | C9.2 62.73,26.4 v60.83,24.5 | C9.2 61.93,26.4 60.33,28 60.33,28.15 | 60.33,28.15 60.33,31.5 v60.83,32 | U6.11 19.65,36.63 18.13,35.1 18.13,26.44 U$6.P$25 | v75.98,24.75 75.79,24.75 arc-45 75.61,24.82 C2.2 | v55.53,26.7 56.52,26.7 arc45 56.7,26.77 58.08,28.15 60.33,28.15
  Bottom 0.305: U1.1 70.8,26.18 67.58,29.4 66.98,29.4 66.13,28.55 66.13,28 67.13,27 67.13,24.15 66.48,23.5 63.83,23.5
  pour Bottom (rank 6): -7.17,49 -8.67,49 -8.67,-19.5 181.33,-19.5 181.33,52 -7.17,52
  pour Top (rank 6): -15.17,53.5 -15.17,-26.5 194.83,-26.5 194.83,52.5 -13.17,52.5 -13.17,54 -15.17,54
  pour Route15 (rank 6): -6.92,65.65 81.13,65.65 81.13,-12.95 -6.92,-12.95
INPUT
  pour Bottom (no thermals): 113.33,28.5 113.33,23 116.83,23 116.83,13.5 116.33,13.5 116.33,8 108.33,8 108.33,-1 120.33,-1 120.33,28.5
KICKER_RX
  Bottom 0.305: U$6.P$9 24.25,1.6 22.43,1.6 21.88,2.15 21.88,28.3 22.71,29.13 U6.7 22.73,30.78
KICKER_RX5V
  Bottom 0.3: U6.14 22.71,40.55 J4.3
KICKER_TX
  Bottom 0.305: U$6.P$8 22.38,4.41 22.38,28.1 23.36,29.09 U6.6
KICKER_TX5V
  Bottom 0.3: U6.15 23.36,38.66 J4.4
MISO  (via drill 0.6)
  Top 0.305: U$1.90 86.33,30.9 86.08,31.15 85.63,31.15 v85.18,31.6 | v65.18,31.2 57.93,31.2 54.13,27.4 54.13,19.85 44.63,10.35 18.9,10.35 TP9.TP
  Route2 0.305: v65.18,31.2 66.83,32.85 73.13,32.85 75.58,30.4 83.93,30.4 85.13,31.6 v85.18,31.6
MISO_MOTOR  (via drill 0.5, 0.6)
  Top 0.3: U$1.53 96.48,17 97.33,16.15 97.33,16.45 98.18,17.3 98.18,21.45 v97.48,22.15
  Top 0.305: U$1.53 96.43,17 97.03,16.4 97.03,11.5 97.98,10.55 102.53,10.55 v102.58,10.5
  Route2 0.3: v87.58,34 85.68,34 85.18,34.5 74.32,34.5 JP2.27
  Route15 0.3: v97.48,22.15 91.33,22.15 87.78,25.7 87.78,28.35 87.28,28.85 87.28,30.1 87.98,30.8 87.98,33.6 v87.58,34
  Route15 0.305: v102.58,10.5 JP1.27
MOSI  (via drill 0.6)
  Top 0.305: TP8.TP 45.02,15.59 52.98,23.55 52.98,29.55 v55.78,32.35 | v82.93,28.15 82.98,27.5 83.23,27.25 86.28,27.25 86.43,27.4 86.43,28.55 85.83,29.15 U$1.91
  Route15 0.305: v55.78,32.35 56.68,33.25 60.98,33.25 61.63,32.6 71.43,32.6 73.18,34.35 76.93,34.35 v78.58,32.7
  Bottom 0.305: v78.58,32.7 78.58,32.15 82.53,28.2 82.93,28.2 v82.93,28.15
MOSI_MOTOR  (via drill 0.6)
  Top 0.3: U$1.54 96.63,17.5 v97.08,17.95
  Top 0.305: U$1.54 93.78,17.5 93.53,17.25 v93.38,17.25
  Route2 0.305: v93.38,17.25 92.43,18.2 92.43,19.15 90.43,21.15 81.48,21.15 80.58,20.25 75.18,20.25 74.83,20.6 74.83,23.75 v75.88,23.75
  Route15 0.3: 103.83,10.75 103.83,11.2 v97.08,17.95 | 77.73,13.25 78.98,14.5 78.98,31.7 79.18,31.9
  Route15 0.305: JP1.29 105.13,7.29 105.13,10 104.38,10.75 103.83,10.75 | v75.88,23.75 77.08,23.8 77.93,23.1 77.93,15.5 76.08,13.65 76.08,12.65 76.43,12.3 77.33,12.3 77.73,12.7 77.73,13.25 | 79.18,31.9 79.58,32.3 79.58,33.15 77.88,34.85 71.43,34.85 JP2.29
N$3
  Top 0.3: C7.2 67.5,18.33 68.33,17.5 68.33,12.5 69.33,11.5 91.83,11.5 92.83,12.5 U$1.49
N$4  (via drill 0.6)
  Top 0.305: U$1.73 96.33,27 97.68,25.65 v97.68,24.85 | v103.68,12.6 103.41,12.33 C6.2
  Route15 0.305: v97.68,24.85 99.53,24.85 103.68,20.7 v103.68,12.6
N$6  (via drill 0.6)
  Top 0.3: R15.2 92.31,32.73 92.13,32.55 84.88,32.55 84.33,32 84.33,31.6 | 84.33,30.75 U$1.94
  Top 0.305: S3.2 v60.43,36.7 | v83.33,32.4 84.33,31.6 84.33,30.75
  Bottom 0.305: v60.43,36.7 64.18,40.45 82.83,40.45 83.53,39.75 83.53,35.3 82.83,34.6 82.83,33.1 v83.33,32.4
N$10
  Top 0.3: C15.2 58.52,9.06 R2.1 58,3.67 Q1.2
N$12
  Top 0.3: R12.1 166.03,12.67 5V.A
N$14
  Top 0.3: R7.2 166.11,15.83 12V.A
N$18
  Top 0.3: BATTERY.A 164.07,6.81 R14.2
N$19
  Top 0.3: 3.3V.A 164.21,9.83 R25.1
N$21
  Top 0.3: R1.2 112.8,40.46 T1.2
N$22  (via drill 0.6)
  Top 0.5: D2.C 112.4,21.13 | 112.4,21.13 U$2.1 | 112.4,21.13 112.4,21.07 v108.68,17.35
  Bottom 0.5: v108.68,17.35 106.53,17.35 103.83,20.05 103.83,23.6 101.88,25.55 99.03,25.55 97.13,27.45 97.13,33.45 98.18,34.5 105.03,34.5 107.53,37 111.88,37 T1.1
N$25
  Bottom 2: U3.2 129.18,8.65 131.83,6 145.83,6 150.83,11 150.83,22.5 157.83,29.5 165.87,29.5 S2.5 S2.2
NRST  (via drill 0.6)
  Top 0.3: S1.2 166.78,21 v166.98,21.2 | v67.23,28.35 67.23,38.3 67.33,38.4 | U$1.14 78.13,21.5 77.7,21.07 76.35,21.07 v76.33,21.05
  Top 0.305: 67.33,38.4 66.98,38.75 C69.1 56.33,38.75 54.98,37.4 44.9,37.4 JP12.P$2
  Route2 0.3: v166.98,21.2 115.93,21.2 113.38,23.75 113.33,23.7 97.53,23.7 97.03,23.2 91.03,23.2 90.48,23.75 82.58,23.75 80.78,21.95 80.78,21.4 78.03,21.4 77.48,20.85 76.53,20.85 v76.33,21.05
  Bottom 0.3: JP12.P$2 43.62,32.42 R6.2 | v76.33,21.05 75.83,21.55 75.83,22 75.73,22.1 68.43,22.1 68.28,22.25 67.58,22.25
  Bottom 0.305: 67.58,22.25 67.58,27.95 67.33,28.2 v67.23,28.35
RST1  (via drill 0.6)
  Top 0.305: U$1.33 84.83,13.05 84.23,12.45 v83.13,12.45
  Route15 0.3: 83.08,10.55 83.08,12.4 v83.13,12.45 | 84.58,5.8 84.38,5.8 83.53,6.65 83.53,8.75 83.78,9
  Route15 0.305: JP1.25 98.56,5.8 84.58,5.8 | 83.78,9 83.78,9.85 83.08,10.55
RST2  (via drill 0.6)
  Top 0.305: U$1.34 85.33,14.95 85.18,15.1 81.03,15.1 80.83,14.9 80.83,14.3 80.53,14 76.03,14 75.08,13.05 v74.58,13.05
  Bottom 0.3: 68.08,7.65 68.08,7.95 71.98,11.85 72.98,11.85 73.48,12.35 73.48,13.05
  Bottom 0.305: v74.58,13.05 73.48,13.05 | 68.08,7.65 68.08,2.35 68.03,2.3 68.48,1.85 95.28,1.85 96.23,2.8 96.23,6.1 97.4,7.27 JP1.23
RST3  (via drill 0.5, 0.6)
  Top 0.3: U$1.35 85.83,12.45 v85.58,12.25 | v82.98,9.35 76.71,9.35 JP1.5
  Bottom 0.305: v85.58,12.25 82.98,9.6 v82.98,9.35
RST4  (via drill 0.5)
  Top 0.3: U$1.44 v90.33,16.85 | v84.58,25.1 82.78,25.1 arc45 82.6,25.03 v82.18,24.6 | v75.23,32.5 74.48,32.5 arc45 74.3,32.43 74.03,32.15 74.03,31.51 arc-45 73.95,31.33 73.48,30.85 70.68,30.85 arc-45 70.5,30.92 69.78,31.65 69.78,33.09 arc-45 69.85,33.27 71.18,34.6 72.39,34.6 arc45 72.57,34.67 JP2.25
  Route15 0.3: v90.33,16.85 90.33,16.89 arc45 90.25,17.07 86.58,20.75 85.13,20.75 arc-45 84.95,20.82 84.83,20.95 84.83,24.75 arc45 84.75,24.92 v84.58,25.1
  Bottom 0.3: v82.18,24.6 79.13,24.6 arc-45 78.95,24.67 77.73,25.9 77.73,29.89 arc45 77.65,30.07 v75.23,32.5
RST5  (via drill 0.5, 0.9)
  Top 0.3: U$1.45 90.83,15.75 arc-45 90.9,15.92 v91.43,16.45
  Route2 0.3: v97.78,41.55 77.68,41.5 arc45 77.55,41.38 75.88,39.9 75.88,38.12 arc45 75.95,37.95 JP2.23
  Route15 0.3: 96.45,40.87 arc45 96.38,40.7 96.38,38.6 95.95,38.17 arc-45 95.77,38.1 94.13,38.1 93.85,38.38 arc-45 93.78,38.55 93.78,40.9 93.15,41.53 arc45 92.97,41.6 89.48,41.6 88.7,40.82 arc45 88.63,40.64 88.63,38.25 88.4,38.02 arc-45 88.22,37.95 83.93,37.95 83.6,37.62 arc45 83.53,37.45 83.53,35.85 82.35,34.67 arc45 82.28,34.49 82.28,31.75 83.98,30.05 84.58,30.05 84.6,30.07 arc45 84.78,30 85.33,30 86.25,29.07 arc-45 86.33,28.89 86.33,25.55 89.6,22.27 arc-45 89.68,22.09 89.68,19.05 90.85,17.87 arc-45 90.93,17.7 91.35,17.27 arc-45 91.43,17.09 v91.43,16.45
  Route15 0.305: 96.45,40.87 97.13,41.55 v97.78,41.55
SCK  (via drill 0.6)
  Top 0.305: U$1.89 v86.83,31.65
  Route2 0.305: v83.68,33.6 61.63,33.6 52.78,42.45 5.68,42.45 4.18,40.95 4.18,24.4 13.03,15.55 TP7.TP
  Bottom 0.305: v83.68,33.6 84.88,33.6 v86.83,31.65
SCL  (via drill 0.6)
  Top 0.305: U$1.92 85.33,28.25 v85.28,28.15
  Route15 0.3: 67.63,15.55 67.63,14.15 69.98,11.8 71.38,11.8
  Route15 0.305: 71.38,11.8 79.28,11.8 83.33,15.85 83.33,26.65 84.43,26.65 85.23,27.45 v85.28,28.15 | 67.63,15.55 67.63,23.85 63.38,28.1 22.88,28.1 21.88,29.1 v21.88,29.6
  Bottom 0.305: U6.8 22.08,30.78 22.08,29.8 v21.88,29.6
SCL5V
  Bottom 0.3: J4.2 20.33,39 21.23,38.1 22.03,38.1 22.06,38.06 U6.13
SDA  (via drill 0.6)
  Top 0.305: U$1.93 84.83,28.85 v84.13,28.15 | v76.48,28.5 69.28,28.5 67.48,26.7 57.93,26.7 56.33,25.1 56.33,19.65 44.78,8.1 17.28,8.1 12.93,12.45 12.93,22.3 12.03,23.2 12.03,27.65 13.43,29.05 20.08,29.05 v20.63,29.6
  Route2 0.305: v84.13,28.15 84.13,28.1 83.18,27.15 77.83,27.15 v76.48,28.5
  Bottom 0.305: v20.63,29.6 21.41,30.38 U6.9
SDA5V
  Bottom 0.3: J4.1 17.83,40.65 17.83,39 18.83,38 20.33,38 20.73,37.6 21.13,37.6 21.41,37.31 U6.12
SS1  (via drill 0.6)
  Top 0.305: U$1.39 87.83,14.9 87.18,15.55 84.23,15.55 83.33,16.45 83.33,18.65 v84.38,19.7
  Route15 0.3: 99.23,11.45 99.23,10.55 101.53,8.3 101.53,6.7 102.18,6
  Route15 0.305: v84.38,19.7 86.43,19.7 94.68,11.45 99.23,11.45 | 102.18,6 103.84,6 JP1.30
SS2  (via drill 0.6)
  Top 0.305: U$1.40 88.33,15.1 87.38,16.05 84.93,16.05 v84.18,16.8
  Route15 0.305: v84.18,16.8 84.18,15.95 85.18,14.95 89.48,14.95 90.83,13.5 90.88,8.75 JP1.19
  Bottom 0.3: JP1.19 92,7.27 90.63,5.9 88.93,5.9 88.68,6.15
SS3  (via drill 0.6)
  Top 0.3: v88.83,12.3 U$1.41
  Bottom 0.3: JP1.17 89.87,11.21 v88.83,12.3
SS4  (via drill 0.6)
  Top 0.305: JP2.30 68.16,39.27 v67.78,39.65 | v90.03,12.3 89.33,13.05 U$1.42
  Route2 0.305: v76.88,13.1 76.88,13.05 78.33,11.6 83.88,11.6 85.38,13.1 89.28,13.1 v90.03,12.3
  Route15 0.305: v76.88,13.1 78.38,14.6 78.38,23.3 71.33,30.35 64.53,30.35 64.08,29.9 55.53,29.9 54.38,31.05 54.38,32.6 61.43,39.65 v67.78,39.65
SS5  (via drill 0.6)
  Top 0.3: 89.23,16.25 89.83,15.65 U$1.43 | 88.68,16.8 85.48,16.8 v85.43,16.85
  Top 0.305: 89.23,16.25 88.68,16.8
  Bottom 0.3: JP2.19 82.3,30.08 | 85.58,26.8 85.58,18.45 | 86.03,29.05 86.28,28.8 86.28,27.5 86.03,27.25
  Bottom 0.305: 82.3,30.08 85,30.08 86.03,29.05 | 86.03,27.25 85.58,26.8 | 85.58,18.45 85.58,17.05 v85.43,16.85
SWCLK  (via drill 0.6)
  Top 0.3: U$1.76 v93.33,31.6
  Bottom 0.3: v93.33,31.6 93.33,36 93.73,36.4 93.73,40.9 92.93,41.7 52.28,41.7 51.74,41.7
  Bottom 0.305: JP12.P$5 48.7,40.82 49.58,41.7 52.28,41.7
SWDIO  (via drill 0.6)
  Top 0.3: U$1.72 93.48,26.5 v93.43,26.55
  Route2 0.3: v93.43,26.55 73.28,26.55 69.53,30.3 42.83,30.3 39.38,33.75 39.38,36.9 40.68,38.2 43.16,38.2 JP12.P$1
TRIGGER5V
  Bottom 0.3: U6.16 24.01,37.69 25.33,39 26.24,39 J4.5
TRIGGER_CHIP5V
  Bottom 0.3: U6.17 24.66,37.34 25.83,38.5 28.28,38.5 J4.6
U1_RX  (via drill 0.6)
  Top 0.3: U$1.67 91.88,24 v91.38,24.5
  Bottom 0.3: v91.38,24.5 89.93,24.5 87.93,22.5 87.93,13.15 87.58,12.8 87.58,12.6
  Bottom 0.305: JP1.11 82.25,7.37 83.68,8.8 85.93,8.8 87.58,10.45 87.58,12.6
U1_TX  (via drill 0.6)
  Top 0.3: U$1.68 93.48,24.5 v92.68,25.3
  Bottom 0.25: 81.23,6.25 81.23,9
  Bottom 0.3: v92.68,25.3 89.33,25.3 86.63,22.6 86.63,14.4 81.4,9.18 | 81.08,6.1 JP1.10
  Bottom 0.305: 81.08,6.1 81.23,6.25 | 81.23,9 81.4,9.18
U2_RX  (via drill 0.6)
  Top 0.305: U$1.26 80.23,12.9 v78.68,12.9
  Bottom 0.3: v78.68,12.9 78.68,8.3 JP1.9
U2_TX  (via drill 0.6)
  Top 0.3: 79.33,15.85 79.33,15.65 v79.93,15.05
  Top 0.305: U$1.25 79.33,15.85
  Bottom 0.2: 80.73,6.55 80.73,8
  Bottom 0.3: 80.13,6 80.18,6 80.73,6.55 | 80.73,8 79.93,8.8
  Bottom 0.305: 80.13,6 79.08,6 78.43,5.35 78.43,4.1 79.03,3.5 81.02,3.5 JP1.12
  Bottom 0.5: v79.93,15.05 79.93,8.8
U3_RX  (via drill 0.6)
  Top 0.2: U$1.48 92.33,15.2 92.38,15.2 v92.78,15.6
  Bottom 0.2: JP1.3 73.33,6.03 73.33,3.4 73.83,2.9 83.08,2.9 83.58,3.4 83.58,8.1 83.83,8.35 86.08,8.35 87.98,10.25 87.98,12.5 88.33,12.85 88.33,15.4 88.58,15.65 92.73,15.65 v92.78,15.6
U3_TX  (via drill 0.6)
  Top 0.3: U$1.47 91.83,12.65 v91.63,12.45
  Route2 0.305: v91.63,12.45 89.68,10.5 71.73,10.5 69.55,8.32 JP1.1
U4_RX  (via drill 0.6)
  Top 0.2: v81.23,16.2 80.93,16.5 U$1.24
  Bottom 0.2: JP2.11 92.41,30.73 91.48,29.8 88.48,29.8 87.18,28.5 87.18,24.05 86.18,23.05 86.18,16 85.53,15.35 82.08,15.35 v81.23,16.2
U4_TX  (via drill 0.6)
  Top 0.3: v82.23,17 U$1.23
  Route2 0.305: v80.58,32.6 81.58,31.6 83.93,31.6 85.23,32.9 91.33,32.9 93.78,35.35 93.78,38.05 94.95,39.22 JP2.10
  Route15 0.3: 81.03,18.2 v82.23,17
  Route15 0.305: 81.03,18.2 80.58,18.65 v80.58,32.6
U5_RX  (via drill 0.6)
  Top 0.3: v88.73,28.15 89.28,28.15 89.73,28.6 89.73,28.85 89.88,29 89.88,29.95 U$1.83
  Bottom 0.3: JP2.9 94.95,29.97 91.93,26.95 89.93,26.95 v88.73,28.15
U5_TX  (via drill 0.6)
  Top 0.3: v91.28,28.45 91.28,29.95 U$1.80
  Route15 0.3: JP2.12 92.41,39.18 91.18,37.95 91.18,28.55 v91.28,28.45
U6_RX  (via drill 0.6)
  Top 0.3: U$1.64 85.13,22.45
  Top 0.305: 85.13,22.45 82.83,20.15 v81.83,20.15
  Bottom 0.3: v81.83,20.15 60.58,20.15 U$6.P$16
U6_TX  (via drill 0.6)
  Top 0.3: U$1.63 85.38,22 82.63,19.25 82.63,19.05 82.23,18.65 v82.03,18.65
  Bottom 0.3: v82.03,18.65 61.13,18.65 47.73,5.25 47.73,2.3
  Bottom 0.406: U$6.P$15 43.02,1.55 46.98,1.55 47.73,2.3
V_CIRCUIT
  Top 2: U$3.VIN 137.08,40.25 145.33,32 165.83,32 S2.6 S2.3
  Bottom 2: S2.6 165.4,32.07 165.33,32 165.83,32 S2.6
VDC_1  (via drill 0.6, 4)
  Top 0.3: R14.1 160.31,6.83 v159.23,5.75 | v155.73,2.1 152.83,2.1 148.68,6.25 148.68,10.6 v147.58,11.7
  Route2 2: v128.78,15.5 128.23,15.5 127.33,16.4
  Bottom 0.3: v159.23,5.75 159.23,5.6 v155.73,2.1 | v147.58,11.7 147.58,13.25 146.58,14.25
  Bottom 1: 141.43,8.9 138.58,8.9 138.18,8.5 132.28,8.5 129.63,11.15
  Bottom 2: U$4.VIN 160.83,41.51 160.83,34 159.33,32.5 155.83,32.5 147.83,24.5 147.83,15.5 146.58,14.25 146.32,13.99 U4.2 142.04,9.51 141.43,8.9 | 129.63,11.15 129.63,14.7 v128.78,15.5
  pour Route2: 71.08,8.4 71.08,-1.7 146.03,-1.7 146.03,17.95 115.23,17.95 115.23,15.75 105.13,15.75 105.13,8.65 71.08,8.65
  pour Route2 (rank 6): 189.18,15.85 189.18,-4.4 186.38,-4.4 186.38,-25.25 -23.57,-25.25 -23.57,15.85
VDC_2  (via drill 5)
  Route2 3: v129.58,39.5 128.53,39.5 127.38,38.35
  Bottom 3: U2.2 142.04,36.34 139.98,38.4 130.68,38.4 v129.58,39.5
  pour Route2: 101.73,42.2 101.73,26.8 146.33,26.8 146.33,42.85 101.73,42.85
  pour Route2 (rank 6): -24.07,19.65 187.93,19.65 187.93,63.3 -23.07,63.3
WAVEFORM5V
  Bottom 0.3: U6.20 31.48,36.63 J4.8
(copper drawn outside any net)
  shapes: Bottom area x1